# EAGLE design n64advanced (EAGLE 8.4.3)

## Sheet 1 of 2
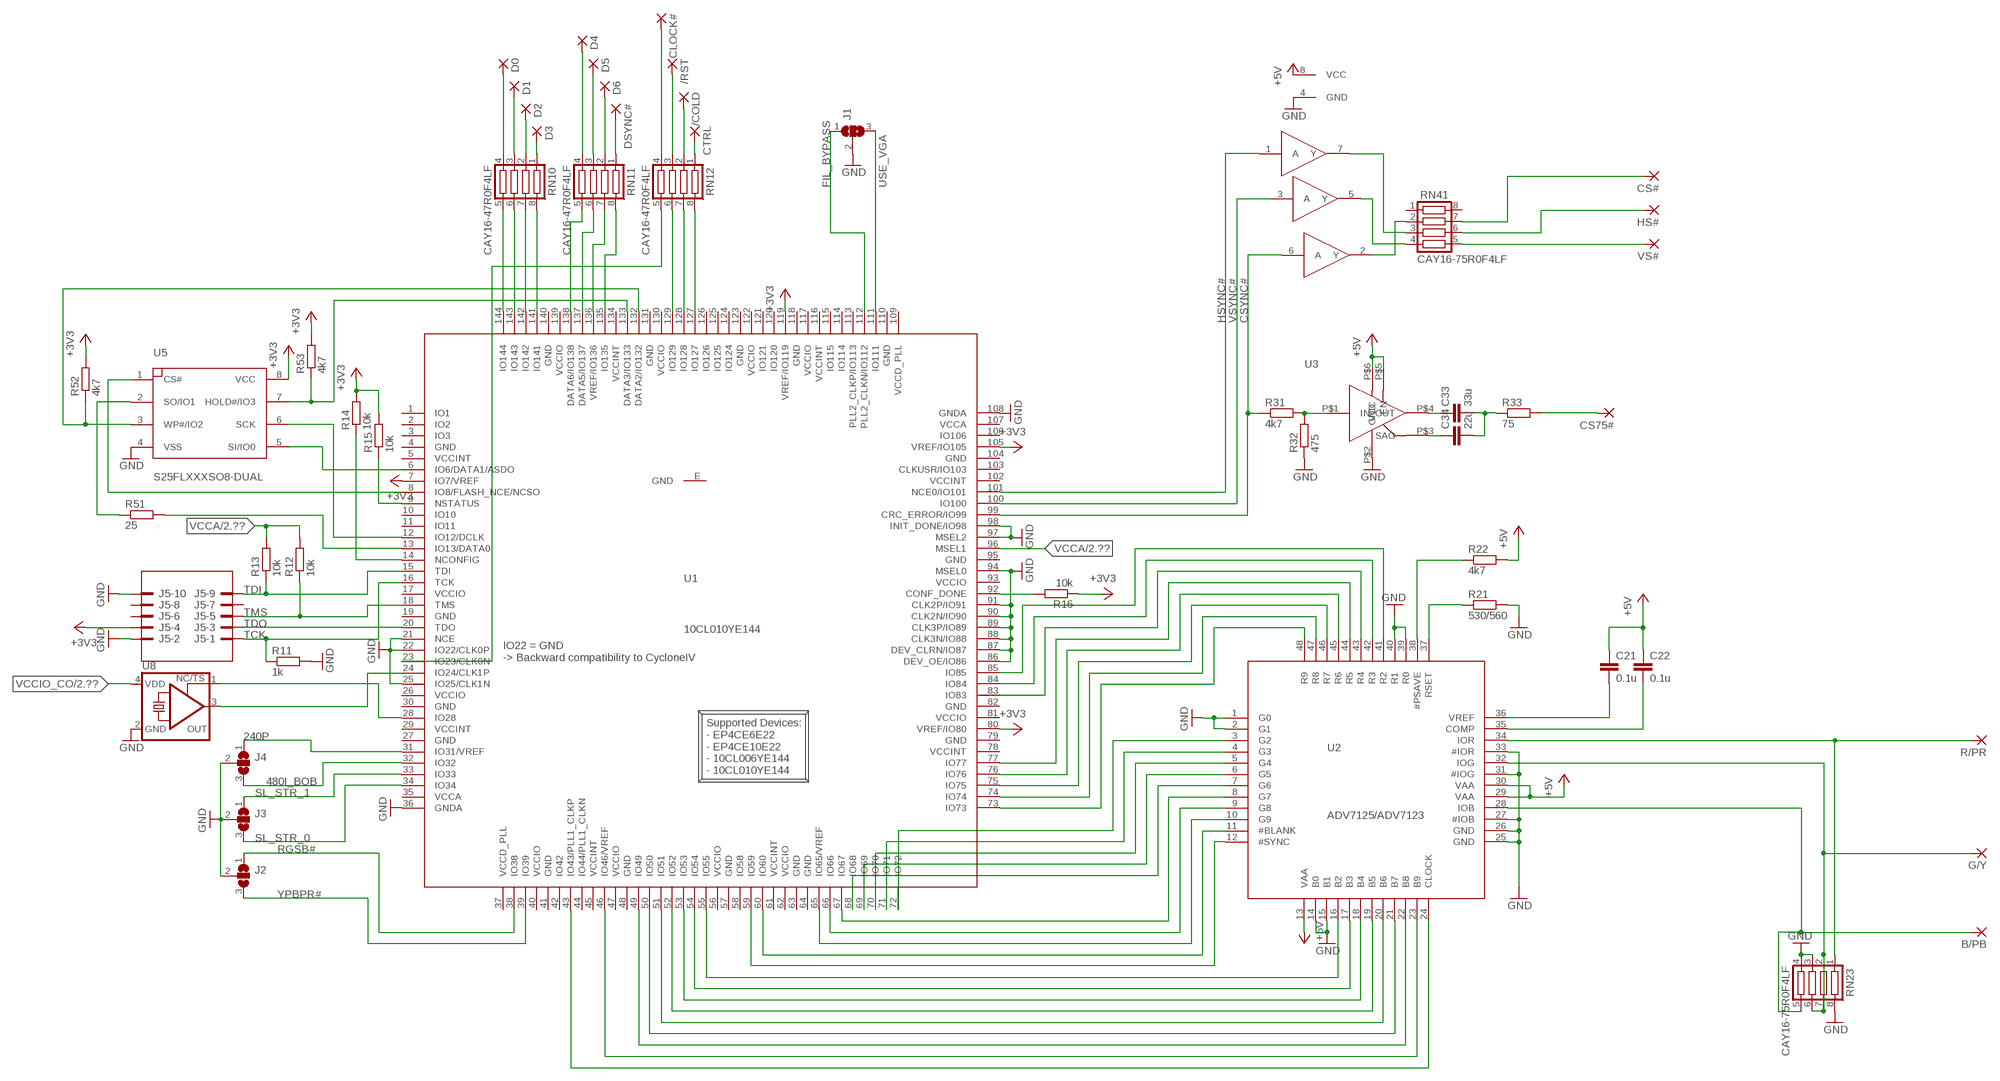
[diagram p0: schematic, sheet 1]

### Parts
/COLD  SMD2  [SMD1,27-2,54]
/RST  SMD2  [SMD1,27-2,54]
B/PB  SMD2  [SMD1,27-2,54]
C21  0.1u  C-EUC0603  [C0603]
C22  0.1u  C-EUC0603  [C0603]
C33  33u  C-EUC1210  [C1210]
C34  22u  C-EUC1206  [C1206]
CLOCK#  SMD1  [SMD0,8-1,6]
CS75#  SMD2  [SMD1,27-2,54]
CS#  SMD2  [SMD1,27-2,54]
CTRL  SMD2  [SMD1,27-2,54]
D0  SMD1  [SMD0,8-1,6]
D1  SMD1  [SMD0,8-1,6]
D2  SMD1  [SMD0,8-1,6]
D3  SMD1  [SMD0,8-1,6]
D4  SMD1  [SMD0,8-1,6]
D5  SMD1  [SMD0,8-1,6]
D6  SMD1  [SMD0,8-1,6]
DSYNC#  SMD1  [SMD0,8-1,6]
G/Y  SMD2  [SMD1,27-2,54]
HS#  SMD2  [SMD1,27-2,54]
J1  SJ2W  [SJ_2]
J2  SJ2W  [SJ_2]
J3  SJ2W  [SJ_2]
J4  SJ2W  [SJ_2]
J5  2510-  [PAK100/2500-10]
R11  1k  R-EU_R0603  [R0603]
R12  10k  R-EU_R0603  [R0603]
R13  10k  R-EU_R0603  [R0603]
R14  10k  R-EU_R0603  [R0603]
R15  10k  R-EU_R0603  [R0603]
R16  10k  R-EU_R0603  [R0603]
R21  530/560  R-EU_R0603  [R0603]
R22  4k7  R-EU_R0603  [R0603]
R31  4k7  R-EU_R0603  [R0603]
R32  475  R-EU_R0603  [R0603]
R33  75  R-EU_R0603  [R0603]
R51  25  R-EU_R0603  [R0603]
R52  4k7  R-EU_R0603  [R0603]
R53  4k7  R-EU_R0603  [R0603]
R/PR  SMD2  [SMD1,27-2,54]
RN10  CAY16-47R0F4LF  CTS742C083  [CTS742C083]
RN11  CAY16-47R0F4LF  CTS742C083  [CTS742C083]
RN12  CAY16-47R0F4LF  CTS742C083  [CTS742C083]
RN23  CAY16-75R0F4LF  CTS742C083  [CTS742C083]
RN41  CAY16-75R0F4LF  CTS742C083  [CTS742C083]
U1  10CL010YE144  [EQFP144_2]
U2  ADV7125/ADV7123  ADV7123  [LQFP48]
U3  TSH122ICT  [SC70]
U4  74LVC3G17  74LVC3G34  [74LVC3G34]
U5  S25FLXXXSO8-DUAL  [SO8-DUAL]
U8  KXO-PXO/XO-V96  [3.2X2.5_KXO-V96]
VS#  SMD2  [SMD1,27-2,54]

### Nets
240P: J4.1 U1.31(IO31/VREF)
480I_BOB: J4.3 U1.32(IO32)
+5V: C21.1 C22.1 R22.2 U2.13(VAA) U2.29(VAA) U2.30(VAA) U3.P$5(EN) U3.P$6(VCC) U4.8(VCC) ; also sheet 2
BLUE: B/PB.1(P) RN23.5 U2.28(IOB)
CSYNC47#: CS#.1(P) RN41.7
CSYNC#: R31.1 U1.99(CRC_ERROR/IO99) U4.6(A)
FIL_BYPASS: J1.1 U1.112(PLL2_CLKN/IO112)
GND: J1.2 J2.2 J3.2 J4.2 J5.2 J5.10 R11.2 R21.2 R32.1 RN23.3 RN23.4 RN23.8 U1.21(NCE) U1.22(IO22/CLK0P) U1.25(IO25/CLK1N) U1.36(GNDA) U1.86(DEV_OE/IO86) U1.87(DEV_CLRN/IO87) U1.88(CLK3N/IO88) U1.89(CLK3P/IO89) U1.90(CLK2N/IO90) U1.91(CLK2P/IO91) U1.94(MSEL0) U1.97(MSEL2) U1.98(INIT_DONE/IO98) U1.108(GNDA) U2.1(G0) U2.2(G1) U2.14(B0) U2.15(B1) U2.25(GND) U2.26(GND) U2.27(#IOB) U2.31(#IOG) U2.33(#IOR) U2.39(R0) U2.40(R1) U3.P$2(GND) U4.4(GND) U5.4(VSS) U8.2(GND) ; also sheet 2
GREEN: G/Y.1(P) RN23.2 RN23.6 RN23.7 U2.32(IOG)
HSYNC47#: HS#.1(P) RN41.6
HSYNC#: U1.101(NCE0/IO101) U4.1(A)
N$1: R31.2 R32.2 U3.P$1(IN)
N$2: R21.1 U2.37(RSET)
N$3: RN12.5 U1.23(IO23/CLK0N)
N$4: U1.43(IO43/PLL1_CLKP) U2.24(CLOCK)
N$5: U1.46(IO46/VREF) U2.23(B9)
N$6: U1.49(IO49) U2.22(B8)
N$7: U1.50(IO50) U2.21(B7)
N$8: R14.1 U1.14(NCONFIG)
N$9: U1.51(IO51) U2.20(B6)
N$10: U1.52(IO52) U2.19(B5)
N$11: U1.53(IO53) U2.18(B4)
N$12: U1.54(IO54) U2.17(B3)
N$13: U1.55(IO55) U2.16(B2)
N$14: U1.72(IO72) U2.3(G2)
N$15: C33.1 U3.P$4(OUT)
N$16: C34.1 U3.P$3(SAG)
N$17: C33.2 C34.2 R33.1
N$18: U1.71(IO71) U2.4(G3)
N$19: U1.70(IO70) U2.5(G4)
N$20: U1.69(IO69) U2.6(G5)
N$21: CS75#.1(P) R33.2
N$22: R22.1 U2.38(#PSAVE)
N$23: C22.2 U2.35(COMP)
N$24: C21.2 U2.36(VREF)
N$25: R52.1 U1.132(DATA2/IO132) U5.3(WP#/IO2)
N$26: RN41.2 U4.2(Y)
N$27: U1.68(IO68) U2.7(G6)
N$28: U1.67(IO67) U2.8(G7)
N$29: U1.66(IO66) U2.9(G8)
N$30: U1.65(IO65/VREF) U2.10(G9)
N$31: U1.60(IO60) U2.11(#BLANK)
N$32: U1.59(IO59) U2.12(#SYNC)
N$33: U1.85(IO85) U2.41(R2)
N$34: U1.84(IO84) U2.42(R3)
N$35: U1.83(IO83) U2.43(R4)
N$36: U1.77(IO77) U2.44(R5)
N$37: U1.76(IO76) U2.45(R6)
N$38: U1.75(IO75) U2.46(R7)
N$39: U1.74(IO74) U2.47(R8)
N$40: U1.73(IO73) U2.48(R9)
N$41: RN10.5 U1.144(IO144)
N$42: RN10.6 U1.143(IO143)
N$43: RN10.7 U1.142(IO142)
N$44: RN10.8 U1.141(IO141)
N$45: R15.1 U1.9(NSTATUS)
N$46: RN11.5 U1.138(DATA6/IO138)
N$47: RN41.4 U4.5(Y)
N$49: RN11.6 U1.137(DATA5/IO137)
N$50: RN11.7 U1.136(VREF/IO136)
N$51: RN11.8 U1.135(IO135)
N$52: R16.2 U1.92(CONF_DONE)
N$53: D0.P$1(P) RN10.4
N$55: RN12.6 U1.129(IO129)
N$56: RN12.7 U1.128(IO128)
N$57: RN12.8 U1.127(IO127)
N$58: D1.P$1(P) RN10.3
N$59: D2.P$1(P) RN10.2
N$60: D3.P$1(P) RN10.1
N$61: D4.P$1(P) RN11.4
N$62: D5.P$1(P) RN11.3
N$63: D6.P$1(P) RN11.2
N$64: DSYNC#.P$1(P) RN11.1
N$65: CLOCK#.P$1(P) RN12.4
N$66: CTRL.1(P) RN12.1
N$67: /COLD.1(P) RN12.2
N$68: RN41.3 U4.7(Y)
N$69: R51.1 U5.2(SO/IO1)
N$70: /RST.1(P) RN12.3
N$72: R51.2 U1.13(IO13/DATA0)
N$73: U1.12(IO12/DCLK) U5.6(SCK)
N$74: R53.1 U1.133(DATA3/IO133) U5.7(HOLD#/IO3)
N$75: U1.8(IO8/FLASH_NCE/NCSO) U5.1(CS#)
N$76: U1.6(IO6/DATA1/ASDO) U5.5(SI/IO0)
N$77: U1.24(IO24/CLK1P) U8.3(OUT)
N$78: U1.28(IO28) U8.1(TS)
RED: R/PR.1(P) RN23.1 U2.34(IOR)
RGSB#: J2.1 U1.38(IO38)
SL_STR_0: J3.3 U1.34(IO34)
SL_STR_1: J3.1 U1.33(IO33)
TCK: J5.1 R11.1 U1.16(TCK)
TDI: J5.9 R13.1 U1.15(TDI)
TDO: J5.3 U1.20(TDO)
TMS: J5.5 R12.1 U1.18(TMS)
USE_VGA: J1.3 U1.111(IO111)
VCCA: R12.2 R13.2 U1.96(MSEL1) ; also sheet 2
VCCIO: J5.4 R14.2 R15.2 R16.1 R52.2 R53.2 U1.7(IO7/VREF) U1.80(VREF/IO80) U1.105(VREF/IO105) U1.119(VREF/IO119) U5.8(VCC) ; supply symbol labelled +3V3 ; also sheet 2
VCCIO_CO: U8.4(VDD) ; also sheet 2
VSYNC47#: RN41.5 VS#.1(P)
VSYNC#: U1.100(IO100) U4.3(A)
YPBPR#: J2.3 U1.39(IO39)
Unconnected: J5.6 J5.7 J5.8 RN41.1 RN41.8 U1.1(IO1) U1.2(IO2) U1.3(IO3) U1.10(IO10) U1.11(IO11) U1.42(IO42) U1.44(IO44/PLL1_CLKN) U1.58(IO58) U1.103(CLKUSR/IO103) U1.106(IO106) U1.113(PLL2_CLKP/IO113) U1.114(IO114) U1.115(IO115) U1.120(IO120) U1.121(IO121) U1.124(IO124) U1.125(IO125) U1.126(IO126)

### Notes on the sheet
- IO22 = GND
  -> Backward compatibility to CycloneIV
- Supported Devices:
  - EP4CE6E22
  - EP4CE10E22
  - 10CL006YE144
  - 10CL010YE144

## Sheet 2 of 2
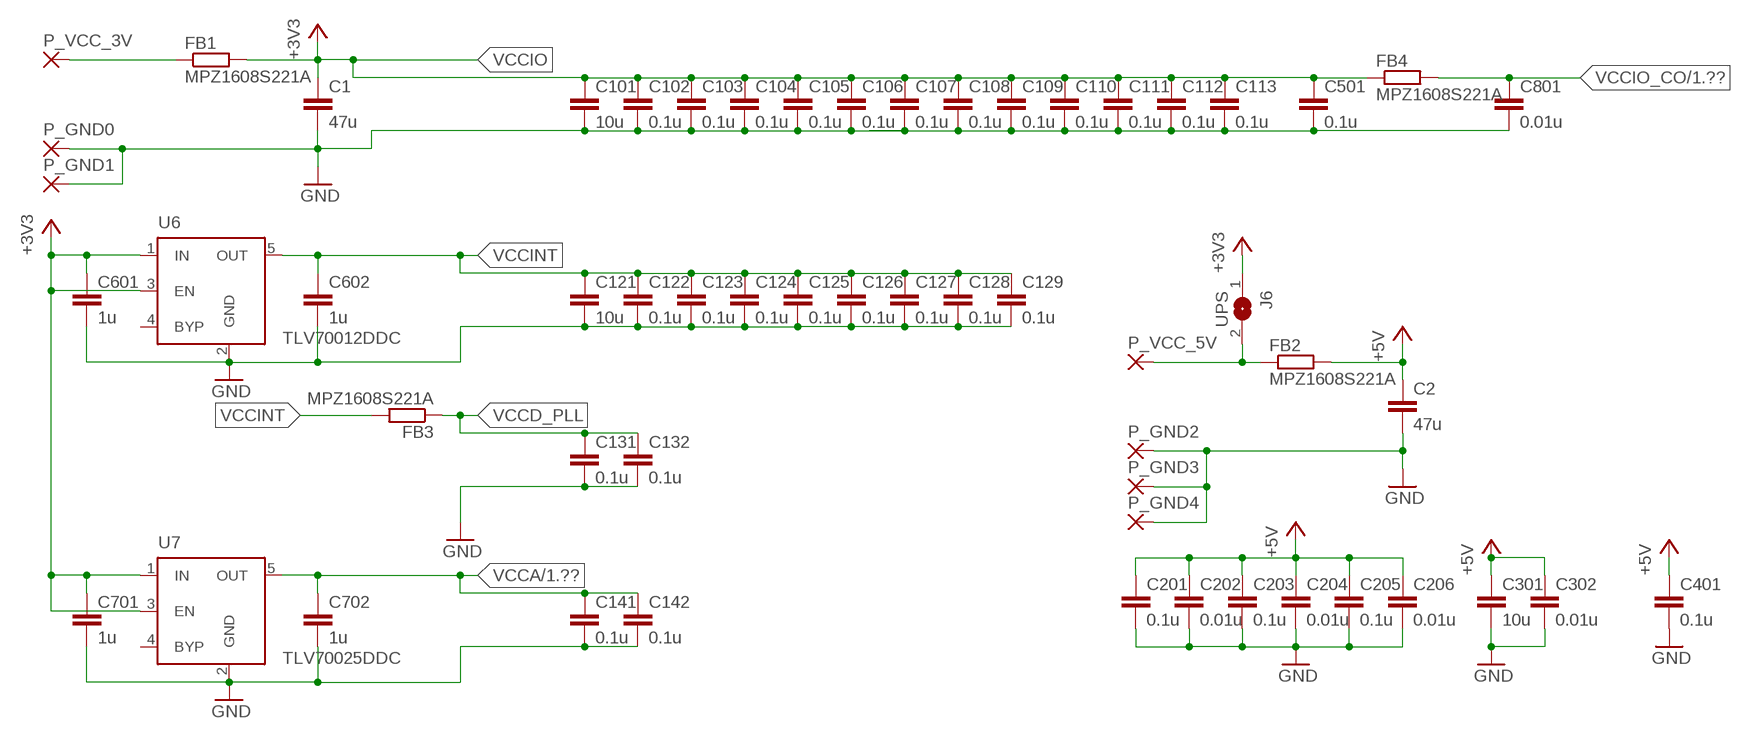
[diagram p1: schematic, sheet 2]

### Parts
C1  47u  C-EUC0805  [C0805]
C2  47u  C-EUC0805  [C0805]
C101  10u  C-EUC0805  [C0805]
C102  0.1u  C-EUC0603  [C0603]
C103  0.1u  C-EUC0603  [C0603]
C104  0.1u  C-EUC0603  [C0603]
C105  0.1u  C-EUC0603  [C0603]
C106  0.1u  C-EUC0603  [C0603]
C107  0.1u  C-EUC0603  [C0603]
C108  0.1u  C-EUC0603  [C0603]
C109  0.1u  C-EUC0603  [C0603]
C110  0.1u  C-EUC0603  [C0603]
C111  0.1u  C-EUC0603  [C0603]
C112  0.1u  C-EUC0603  [C0603]
C113  0.1u  C-EUC0603  [C0603]
C121  10u  C-EUC0805  [C0805]
C122  0.1u  C-EUC0603  [C0603]
C123  0.1u  C-EUC0603  [C0603]
C124  0.1u  C-EUC0603  [C0603]
C125  0.1u  C-EUC0603  [C0603]
C126  0.1u  C-EUC0603  [C0603]
C127  0.1u  C-EUC0603  [C0603]
C128  0.1u  C-EUC0603  [C0603]
C129  0.1u  C-EUC0603  [C0603]
C131  0.1u  C-EUC0603  [C0603]
C132  0.1u  C-EUC0603  [C0603]
C141  0.1u  C-EUC0603  [C0603]
C142  0.1u  C-EUC0603  [C0603]
C201  0.1u  C-EUC0603  [C0603]
C202  0.01u  C-EUC0603  [C0603]
C203  0.1u  C-EUC0603  [C0603]
C204  0.01u  C-EUC0603  [C0603]
C205  0.1u  C-EUC0603  [C0603]
C206  0.01u  C-EUC0603  [C0603]
C301  10u  C-EUC0805  [C0805]
C302  0.01u  C-EUC0603  [C0603]
C401  0.1u  C-EUC0603  [C0603]
C501  0.1u  C-EUC0603  [C0603]
C601  1u  C-EUC0603  [C0603]
C602  1u  C-EUC0603  [C0603]
C701  1u  C-EUC0603  [C0603]
C702  1u  C-EUC0603  [C0603]
C801  0.01u  C-EUC0603  [C0603]
FB1  MPZ1608S221A  R-EU_R0603  [R0603]
FB2  MPZ1608S221A  R-EU_R0603  [R0603]
FB3  MPZ1608S221A  R-EU_R0603  [R0603]
FB4  MPZ1608S221A  R-EU_R0603  [R0603]
J6  UPS  SJ  [SJ]
P_GND0  SMD2  [SMD1,27-2,54]
P_GND1  SMD2  [SMD1,27-2,54]
P_GND2  SMD2  [SMD1,27-2,54]
P_GND3  SMD2  [SMD1,27-2,54]
P_GND4  SMD2  [SMD1,27-2,54]
P_VCC_3V  SMD2  [SMD1,27-2,54]
P_VCC_5V  SMD2  [SMD1,27-2,54]
U6  TLV70012DDC  MIC5219XX  [SOT23-5]
U7  TLV70025DDC  MIC5219XX  [SOT23-5]

### Nets
+5V: C2.1 C201.1 C202.1 C203.1 C204.1 C205.1 C206.1 C301.1 C302.1 C401.1 FB2.2 ; also sheet 1
GND: C1.2 C2.2 C101.2 C102.2 C103.2 C104.2 C105.2 C106.2 C107.2 C108.2 C109.2 C110.2 C111.2 C112.2 C113.2 C121.2 C122.2 C123.2 C124.2 C125.2 C126.2 C127.2 C128.2 C129.2 C131.2 C132.2 C141.2 C142.2 C201.2 C202.2 C203.2 C204.2 C205.2 C206.2 C301.2 C302.2 C401.2 C501.2 C601.2 C602.2 C701.2 C702.2 C801.2 P_GND0.1(P) P_GND1.1(P) P_GND2.1(P) P_GND3.1(P) P_GND4.1(P) U6.2(GND) U7.2(GND) ; also sheet 1
N$48: FB2.1 J6.2 P_VCC_5V.1(P)
N$54: FB1.1 P_VCC_3V.1(P)
VCCA: C141.1 C142.1 C702.1 U7.5(OUT) ; also sheet 1
VCCD_PLL: C131.1 C132.1 FB3.1
VCCINT: C121.1 C122.1 C123.1 C124.1 C125.1 C126.1 C127.1 C128.1 C129.1 C602.1 FB3.2 U6.5(OUT)
VCCIO: C1.1 C101.1 C102.1 C103.1 C104.1 C105.1 C106.1 C107.1 C108.1 C109.1 C110.1 C111.1 C112.1 C113.1 C501.1 C601.1 C701.1 FB1.2 FB4.1 J6.1 U6.1(IN) U6.3(EN) U7.1(IN) U7.3(EN) ; supply symbol labelled +3V3 ; also sheet 1
VCCIO_CO: C801.1 FB4.2 ; also sheet 1
Unconnected: U6.4(BYP) U7.4(BYP)

## Power pins joined to a net without a drawn wire
GND: U1.4(GND) U1.19(GND) U1.27(GND) U1.30(GND) U1.41(GND) U1.48(GND) U1.57(GND) U1.63(GND) U1.64(GND) U1.79(GND) U1.82(GND) U1.95(GND) U1.104(GND) U1.110(GND) U1.118(GND) U1.123(GND) U1.131(GND) U1.140(GND) U1.E(GND)
VCCA: U1.35(VCCA) U1.107(VCCA)
VCCD_PLL: U1.37(VCCD_PLL) U1.109(VCCD_PLL)
VCCINT: U1.5(VCCINT) U1.29(VCCINT) U1.45(VCCINT) U1.61(VCCINT) U1.78(VCCINT) U1.102(VCCINT) U1.116(VCCINT) U1.134(VCCINT)
VCCIO: U1.17(VCCIO) U1.26(VCCIO) U1.40(VCCIO) U1.47(VCCIO) U1.56(VCCIO) U1.62(VCCIO) U1.81(VCCIO) U1.93(VCCIO) U1.117(VCCIO) U1.122(VCCIO) U1.130(VCCIO) U1.139(VCCIO)

## Library data of the parts
/COLD /RST B/PB CS75# CS# CTRL G/Y HS# P_GND0 P_GND1-P_GND4 P_VCC_3V P_VCC_5V R/PR VS# = wirepad@1:SMD2: SMD PAD
C1 C2 C21 C22 C34 C101-C113 C121-C129 C131 C132 C141 C142 C201-C206 C301 C302 C401 C501 C601 C602 C701 C702 C801 = rcl:C-EU: CAPACITOR, European symbol
C33 = rcl@1:C-EU: CAPACITOR, European symbol
CLOCK# D0 D1-D6 DSYNC# = wirepad:SMD1
FB1-FB4 R11-R16 R21 R22 R31-R33 R51-R53 = rcl:R-EU_: RESISTOR, European symbol
J1-J4 = jumper:SJ2W: SMD solder JUMPER
J5 = con-3m:2510-: 3M (TM) Pak 100 4-Wall Header Source: 3M; MF: 3M; MPN: 2510-6002UB; OC_FARNELL: 9838244; OC_NEWARK: 46F4725
J6 = jumper:SJ: SMD solder JUMPER
RN10-RN12 RN23 RN41 = resistor-net:CTS742C083: Chip Resistor Array 4 Single Resistor Source: http://www.ctscorp.com/components/Datasheets/CTSChipArrayDs.pdf; OC_FARNELL: unknown; OC_NEWARK: unknown
U1 = altera:10CL010
U2 = analog-devices:ADV7123
U3 = st-microelectronics:TSH122
U4 = OSSC_HDMI_Audio:74LVC3G34
U5 = cypress:S25FLXXX
U6 U7 = v-reg-micrel:MIC5219XX: VOLTAGE REGULATOR; OC_FARNELL: unknown; OC_NEWARK: unknown
U8 = crystal-geyer_V1_0:KXO-PXO/XO-V: Clock Oscillator (PXO/XO) MHz : KXO-V - Serie Model Size l/w/h [mm] Frequency Range Frequency Stability Temp. Range [°C] Output AECQ 200 availabel Datasheet KXO-V94 KXO-V94 KXO-V95 KXO-V95 KXO-V96 KXO-V96 KXO-V99 KXO-V99 KXO-97 KXO-V97 KXO-97 - KXO-V97 2.0/1.6/0.80 2.0/1.6/0.80 2.5/2.0/0.82 2.5/2.0/0.82 3.2/2.5/1.2 3.2/2.5/1.2 5.0/3.2/1.2 5.0/3.2/1.2 7.0/5.08/1.3 7.0/5.08/1.3 7.0/5.08/1.3 32,768 kHz 1,0 ~ 80,0 MHz 32,768 kHz 1,0 ~ 70,0 MHz 32,768 kHz 1,0 ~ 156,0 MHz 32,768 kHz 1,0 ~ 200,0 MHz 32,768 kHz 32,768 kHz 1,0 ~ 160,0 MHz ±25 … ±100ppm ±25 … ±100ppm ±25 … ±100ppm ±25 … ±100ppm ±25 … ±100ppm ±25 … ±100ppm ±25 … ±100ppm ±25 … ±100ppm ±25 … ±100ppm ±25 … ±100ppm ±25 … ±100ppm (*) -40°C …+85°C (*) -40°C …+85°C (*) -40°C …+85°C (*) -40°C …+85°C (*) -40°C …+85°C (*) -40°C …+85°C (*) -40°C …+85°C (*) -40°C …+85°C (*) -40°C …+85°C (*) -40°C …+85°C (*) -40°C …+85°C HCMOS HCMOS HCMOS HCMOS HCMOS HCMOS HCMOS HCMOS HCMOS HCMOS HCMOS - - yes yes yes yes - - - - - KXO-V94-kHz.pdf <http://www.geyer-electronic.de/uploads/tx_userartikelfrequenz/GEYER-KXO-V94-kHz.pdf> KXO-V94.pdf <http://www.geyer-electronic.de/uploads/tx_userartikelfrequenz/GEYER-KXO-V94.pdf> KXO-V95-kHz.pdf <http://www.geyer-electronic.de/uploads/tx_userartikelfrequenz/GEYER-KXO-V95-kHz.pdf> KXO-V95.pdf <http://www.geyer-electronic.de/uploads/tx_userartikelfrequenz/GEYER-KXO-V95.pdf> KXO-V96-kHz.pdf <http://www.geyer-electronic.de/uploads/tx_userartikelfrequenz/GEYER-KXO-V96-kHz.pdf> KXO-V96.pdf <http://www.geyer-electronic.de/uploads/tx_userartikelfrequenz/GEYER-KXO-V96.pdf> KXO-V99-kHz.pdf <http://www.geyer-electronic.de/uploads/tx_userartikelfrequenz/GEYER-KXO-V99-kHz.pdf> KXO-V99.pdf <http://www.geyer-electronic.de/uploads/tx_userartikelfrequenz/GEYER-KXO-V99.pdf> KXO-97-kHz.pdf <http://www.geyer-electronic.de/uploads/tx_userartikelfrequenz/GEYER-KXO-97-kHz.pdf> KXO-V97-kHz.pdf <http://www.geyer-electronic.de/uploads/tx_userartikelfrequenz/GEYER-KXO-V97-kHz.pdf> KXO-V97.pdf <http://www.geyer-electronic.de/uploads/tx_userartikelfrequenz/GEYER-KXO-V97.pdf> <http://www.geyer-electronic.de/fileadmin/template/img/logo-geyer-electronic.png> Details see: http://www.geyer-electronic.de/Frequenz-Produkte.9.0.html Created 2016-06-07, Hans Locher 2016 (C) Geyer Quartz Technology Hans Locher KXOV94,KXOV95;KXOV96;KXOV97;KXO97;2016;2520;3225;5032;70508;2,5x2,0;3,2x2,5;5,0x3,2;7,0x5,08;2.5x2.0;3.2x2.5;5.0x3.2;7.0x5.08;

## Board
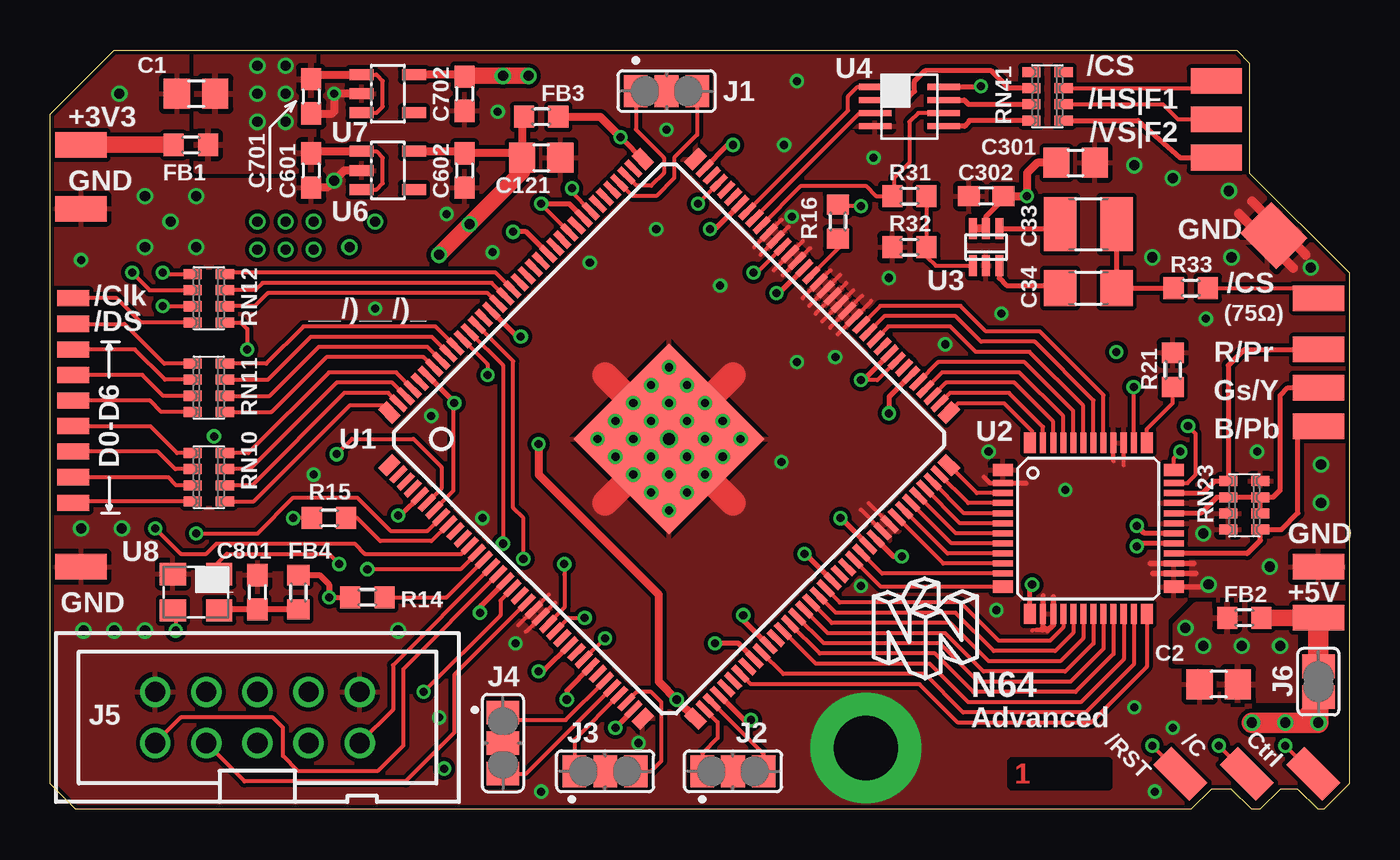
[diagram p2: board, top side]
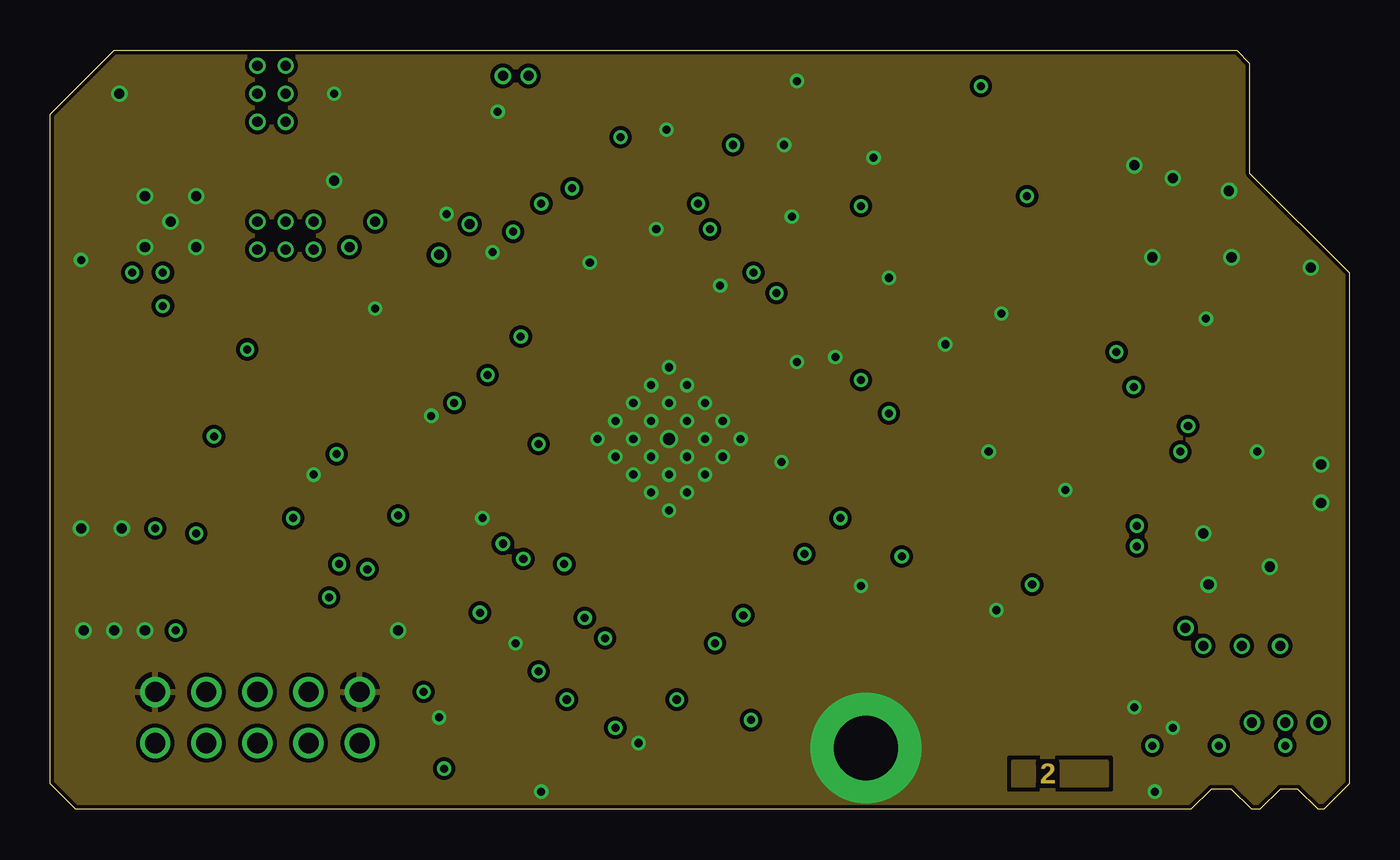
[diagram p3: board, inner layer Route2]
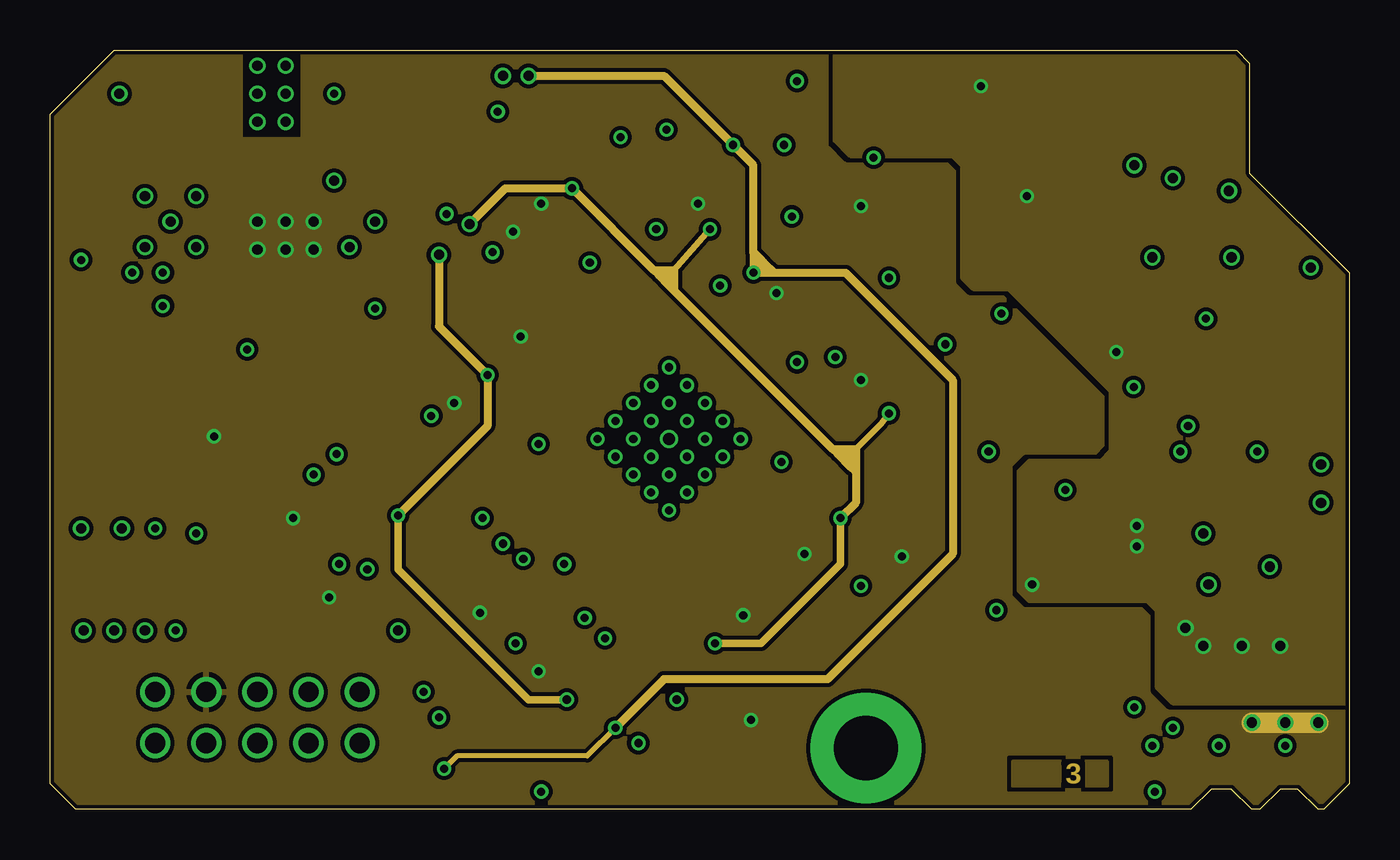
[diagram p4: board, inner layer Route15]
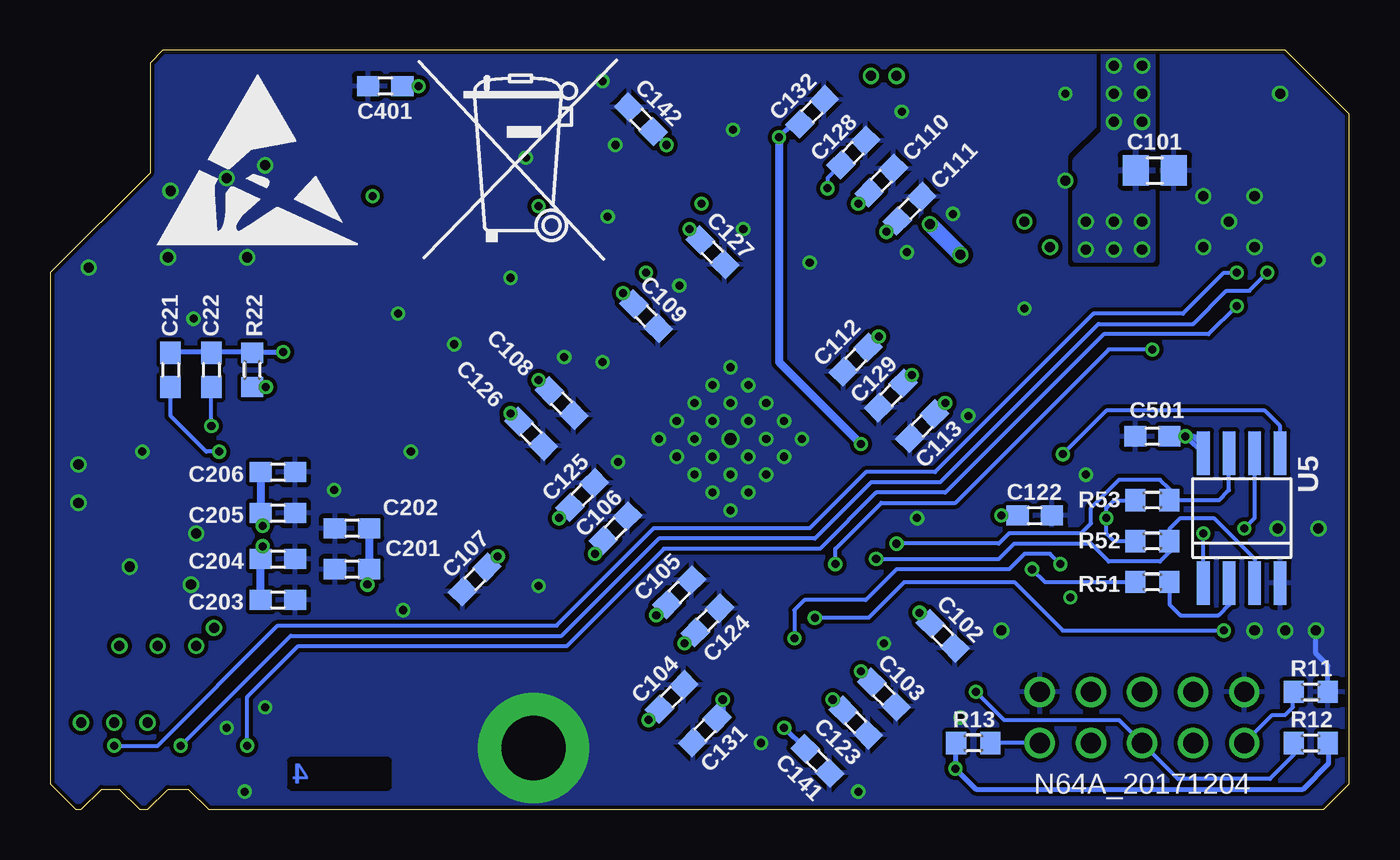
[diagram p5: board, bottom side, seen from below]

Size 64.52 x 37.72 mm. Coordinates in mm from the lower left corner, seen from the top.
Outline: 1.27,0 0,1.27 0,34.54 3.17,37.72 58.93,37.72 59.56,37.08 59.56,31.62 64.52,26.67 64.52,1.27 63.25,0 62.99,0 61.98,1.02 61.09,1.02 60.07,0 59.69,0 58.67,1.02 57.66,1.02 56.64,0 1.27,0
Copper layers (1+2*15+16): Top 0.035mm / dielectric 0.2mm / Route2 0.035mm / dielectric 1.15mm / Route15 0.035mm / dielectric 0.2mm / Bottom 0.035mm
Design rules "PCBCart *": minimum track width 0.2mm, minimum drill 0.4mm, track to track 0.2mm, track to pad 0.2mm, pad to pad 0.2mm, via to via 0.2mm, smd to smd 0mil, copper to edge 0.2mm, drill to drill 0.2mm, minimum pad ring 10mil, minimum via ring 6mil, stop-mask expansion 2mil, vias tented up to drill 30mil, thermal gap 10mil
tRestrict: area 47.7,1 to 52.7,2.5; area 7,11.9 to 7.5,12.4; area 9.1,11.9 to 9.7,12.4; area 11,11.9 to 11.6,12.4; area 15.4,9.8 to 16.1,11.4; 2 lines
bRestrict: area 47.7,1 to 52.7,2.5

### Footprints (pad centres in the part's own frame; a part is rotated, then mirrored left to right if it is on the bottom)
SMD1,27-2,54 = smd 1.27 x 2.54: 1 0,0
C0805 = smd 1.3 x 1.5: 1 -0.95,0; 2 0.95,0
C0603 = smd 1.1 x 1: 1 -0.85,0; 2 0.85,0
C1210 = smd 1.6 x 2.7: 1 -1.4,0; 2 1.4,0
C1206 = smd 1.6 x 1.8: 1 -1.4,0; 2 1.4,0
SMD0,8-1,6 = smd 0.8 x 1.6: P$1 0,0
R0603 = smd 1 x 1.1: 1 -0.85,0; 2 0.85,0
SJ_2 = smd 1.168 x 1.6: 1 -1.524,0; 2 0,0; 3 1.524,0
PAK100/2500-10 = drill 1 pad 1.422: 1 -5.08,-1.27; 2 -5.08,1.27; 3 -2.54,-1.27; 4 -2.54,1.27; 5 0,-1.27; 6 0,1.27; 7 2.54,-1.27; 8 2.54,1.27; 9 5.08,-1.27; 10 5.08,1.27
SJ = smd 1.168 x 1.6: 1 -0.762,0; 2 0.762,0
CTS742C083 = smd 0.5 x 0.9: 1 -1.2,-0.8; 2 -0.4,-0.8; 3 0.4,-0.8; 4 1.2,-0.8; 5 1.2,0.8; 6 0.4,0.8; 7 -0.4,0.8; 8 -1.2,0.8
EQFP144_2 = smd 1 x 0.6: 1 -10.75,8.9; 36 -10.75,-8.9; 73 10.75,-8.9; 108 10.75,8.9 | smd 1 x 0.3: 2 -10.75,8.25; 3 -10.75,7.75; 4 -10.75,7.25; 5 -10.75,6.75; 6 -10.75,6.25; 7 -10.75,5.75; 8 -10.75,5.25; 9 -10.75,4.75; 10 -10.75,4.25; 11 -10.75,3.75; 12 -10.75,3.25; 13 -10.75,2.75; 14 -10.75,2.25; 15 -10.75,1.75; 16 -10.75,1.25; 17 -10.75,0.75; 18 -10.75,0.25; 19 -10.75,-0.25; 20 -10.75,-0.75; 21 -10.75,-1.25; 22 -10.75,-1.75; 23 -10.75,-2.25; 24 -10.75,-2.75; 25 -10.75,-3.25; 26 -10.75,-3.75; 27 -10.75,-4.25; 28 -10.75,-4.75; 29 -10.75,-5.25; 30 -10.75,-5.75; 31 -10.75,-6.25; 32 -10.75,-6.75; 33 -10.75,-7.25; 34 -10.75,-7.75; 35 -10.75,-8.25; 74 10.75,-8.25; 75 10.75,-7.75; 76 10.75,-7.25; 77 10.75,-6.75; 78 10.75,-6.25; 79 10.75,-5.75; 80 10.75,-5.25; 81 10.75,-4.75; 82 10.75,-4.25; 83 10.75,-3.75; 84 10.75,-3.25; 85 10.75,-2.75; 86 10.75,-2.25; 87 10.75,-1.75; 88 10.75,-1.25; 89 10.75,-0.75; 90 10.75,-0.25; 91 10.75,0.25; 92 10.75,0.75; 93 10.75,1.25; 94 10.75,1.75; 95 10.75,2.25; 96 10.75,2.75; 97 10.75,3.25; 98 10.75,3.75; 99 10.75,4.25; 100 10.75,4.75; 101 10.75,5.25; 102 10.75,5.75; 103 10.75,6.25; 104 10.75,6.75; 105 10.75,7.25; 106 10.75,7.75; 107 10.75,8.25 | smd 0.6 x 1: 37 -8.9,-10.75; 72 8.9,-10.75; 109 8.9,10.75; 144 -8.9,10.75 | smd 0.3 x 1: 38 -8.25,-10.75; 39 -7.75,-10.75; 40 -7.25,-10.75; 41 -6.75,-10.75; 42 -6.25,-10.75; 43 -5.75,-10.75; 44 -5.25,-10.75; 45 -4.75,-10.75; 46 -4.25,-10.75; 47 -3.75,-10.75; 48 -3.25,-10.75; 49 -2.75,-10.75; 50 -2.25,-10.75; 51 -1.75,-10.75; 52 -1.25,-10.75; 53 -0.75,-10.75; 54 -0.25,-10.75; 55 0.25,-10.75; 56 0.75,-10.75; 57 1.25,-10.75; 58 1.75,-10.75; 59 2.25,-10.75; 60 2.75,-10.75; 61 3.25,-10.75; 62 3.75,-10.75; 63 4.25,-10.75; 64 4.75,-10.75; 65 5.25,-10.75; 66 5.75,-10.75; 67 6.25,-10.75; 68 6.75,-10.75; 69 7.25,-10.75; 70 7.75,-10.75; 71 8.25,-10.75; 110 8.25,10.75; 111 7.75,10.75; 112 7.25,10.75; 113 6.75,10.75; 114 6.25,10.75; 115 5.75,10.75; 116 5.25,10.75; 117 4.75,10.75; 118 4.25,10.75; 119 3.75,10.75; 120 3.25,10.75; 121 2.75,10.75; 122 2.25,10.75; 123 1.75,10.75; 124 1.25,10.75; 125 0.75,10.75; 126 0.25,10.75; 127 -0.25,10.75; 128 -0.75,10.75; 129 -1.25,10.75; 130 -1.75,10.75; 131 -2.25,10.75; 132 -2.75,10.75; 133 -3.25,10.75; 134 -3.75,10.75; 135 -4.25,10.75; 136 -4.75,10.75; 137 -5.25,10.75; 138 -5.75,10.75; 139 -6.25,10.75; 140 -6.75,10.75; 141 -7.25,10.75; 142 -7.75,10.75; 143 -8.25,10.75 | smd 6.7 x 6.7: E 0,0
LQFP48 = smd 1 x 0.6: 1 -4.25,2.9; 12 -4.25,-2.9; 25 4.25,-2.9; 36 4.25,2.9 | smd 1 x 0.3: 2 -4.25,2.25; 3 -4.25,1.75; 4 -4.25,1.25; 5 -4.25,0.75; 6 -4.25,0.25; 7 -4.25,-0.25; 8 -4.25,-0.75; 9 -4.25,-1.25; 10 -4.25,-1.75; 11 -4.25,-2.25; 26 4.25,-2.25; 27 4.25,-1.75; 28 4.25,-1.25; 29 4.25,-0.75; 30 4.25,-0.25; 31 4.25,0.25; 32 4.25,0.75; 33 4.25,1.25; 34 4.25,1.75; 35 4.25,2.25 | smd 0.6 x 1: 13 -2.9,-4.25; 24 2.9,-4.25; 37 2.9,4.25; 48 -2.9,4.25 | smd 0.3 x 1: 14 -2.25,-4.25; 15 -1.75,-4.25; 16 -1.25,-4.25; 17 -0.75,-4.25; 18 -0.25,-4.25; 19 0.25,-4.25; 20 0.75,-4.25; 21 1.25,-4.25; 22 1.75,-4.25; 23 2.25,-4.25; 38 2.25,4.25; 39 1.75,4.25; 40 1.25,4.25; 41 0.75,4.25; 42 0.25,4.25; 43 -0.25,4.25; 44 -0.75,4.25; 45 -1.25,4.25; 46 -1.75,4.25; 47 -2.25,4.25
SC70 = smd 0.4 x 1.05: P$1 -0.65,-0.925; P$2 0,-0.925; P$3 0.65,-0.925; P$4 0.65,0.925; P$5 0,0.925; P$6 -0.65,0.925
74LVC3G34 = smd 1.6 x 0.3: 1 -1.7,0.975; 2 -1.7,0.325; 3 -1.7,-0.325; 4 -1.7,-0.975; 5 1.7,-0.975; 6 1.7,-0.325; 7 1.7,0.325; 8 1.7,0.975
SO8-DUAL = smd 2.159 x 0.635: 1 -3.226,1.905; 2 -3.226,0.635; 3 -3.226,-0.635; 4 -3.226,-1.905; 5 3.226,-1.905; 6 3.226,-0.635; 7 3.226,0.635; 8 3.226,1.905
SOT23-5 = smd 0.55 x 1.2: 1 -0.95,-1.3; 2 0,-1.3; 3 0.95,-1.3; 4 0.95,1.3; 5 -0.95,1.3
3.2X2.5_KXO-V96 = smd 1.3 x 1.1: 1 -1.15,-0.9; 2 1.15,-0.9; 3 1.15,0.9; 4 -1.15,0.9

### Placement (x,y rotation side)
/COLD  59.44,1.78 45 top
/RST  56.13,1.78 45 top
B/PB  62.99,19.05 90 top
C1  7.24,35.56 180 top
C2  58.04,6.22 180 top
C21  58.55,21.84 270 bottom
C22  56.52,21.84 270 bottom
C33  51.56,29.08 0 top
C34  51.56,25.91 0 top
C101  9.65,31.75 0 bottom
C102  20.19,8.64 315 bottom
C103  23.11,5.71 315 bottom
C104  33.66,5.59 45 bottom
C105  33.27,10.79 45 bottom
C106  36.45,13.97 45 bottom
C107  43.43,11.43 225 bottom
C108  39.12,20.19 315 bottom
C109  34.92,24.51 315 bottom
C110  23.24,31.24 45 bottom
C111  21.84,29.84 45 bottom
C112  24.51,22.35 225 bottom
C113  21.21,19.05 225 bottom
C121  24.38,32.38 0 top
C122  15.62,14.61 0 bottom
C123  24.51,4.32 315 bottom
C124  31.88,9.4 45 bottom
C125  38.1,15.62 45 bottom
C126  40.64,18.67 315 bottom
C127  31.62,27.69 315 bottom
C128  24.64,32.64 45 bottom
C129  22.76,20.57 225 bottom
C131  32,3.94 225 bottom
C132  26.68,34.66 45 bottom
C141  26.42,2.41 315 bottom
C142  35.18,34.29 135 bottom
C201  49.53,11.94 180 bottom
C202  49.53,13.97 180 bottom
C203  53.21,10.41 0 bottom
C204  53.21,12.45 0 bottom
C205  53.21,14.73 0 bottom
C206  53.21,16.76 0 bottom
C301  50.93,32.13 0 top
C302  46.48,30.48 180 top
C401  47.88,35.94 180 bottom
C501  9.78,18.54 180 bottom
C601  12.95,31.75 270 top
C602  20.57,31.75 270 top
C701  12.95,35.43 270 top
C702  20.57,35.56 270 top
C801  10.29,10.79 90 top
CLOCK#  1.14,25.4 270 top
CS75#  62.99,25.4 90 top
CS#  57.91,36.2 90 top
CTRL  62.74,1.78 45 top
D0  1.14,15.24 270 top
D1  1.14,16.51 270 top
D2  1.14,17.78 270 top
D3  1.14,19.05 270 top
D4  1.14,20.32 270 top
D5  1.14,21.59 270 top
D6  1.14,22.86 270 top
DSYNC#  1.14,24.13 270 top
FB1  6.98,33.02 0 top
FB2  59.31,9.53 180 top
FB3  24.38,34.42 180 top
FB4  12.32,10.79 270 top
G/Y  62.99,20.95 90 top
HS#  57.91,34.29 90 top
J1  30.61,35.69 180 top
J2  33.91,1.91 0 top
J3  27.56,1.91 0 top
J4  22.48,3.3 270 top
J5  10.29,4.57 0 top
J6  62.99,6.35 90 top
P_GND0  1.52,29.84 90 top
P_GND1  1.52,12.06 90 top
P_GND2  62.99,12.06 90 top
P_GND3  61.09,28.83 45 top
P_GND4  60.45,28.19 45 top
P_VCC_3V  1.52,33.02 90 top
P_VCC_5V  62.99,9.53 90 top
R11  1.91,5.84 0 bottom
R12  1.91,3.3 0 bottom
R13  18.67,3.3 180 bottom
R14  15.75,10.54 180 top
R15  13.84,14.48 180 top
R16  39.12,29.21 270 top
R21  518/515  [R0603]  55.75,21.84 90 top
R22  54.48,21.84 90 bottom
R31  42.67,30.48 0 top
R32  42.67,27.94 0 top
R33  56.64,25.91 0 top
R51  9.78,11.3 180 bottom
R52  9.78,13.34 180 bottom
R53  9.78,15.37 180 bottom
R/PR  62.99,22.86 90 top
RN10  7.87,16.51 270 top
RN11  7.87,20.95 270 top
RN12  7.87,25.4 270 top
RN23  59.31,15.11 270 top
RN41  49.53,35.43 270 top
U1  30.73,18.41 45 top
U2  51.56,13.97 0 top
U3  46.48,27.94 0 top
U4  42.67,34.92 0 top
U5  5.33,14.48 90 bottom
U6  16.76,31.75 270 top
U7  16.76,35.56 270 top
U8  7.24,10.79 180 top
U$1  [ESD_10.00]  59.31,27.94 0 bottom
U$2  [MUELLTONNE_10.00]  46.86,26.92 0 bottom
VS#  57.91,32.38 90 top

### Tracks (layer width: path | path; a pad name or v marks a point on that pad's centre or on a via)
240P
  Top 0.203: J4.1 22.86,4.45 25.6,4.45 U1.31
480I_BOB
  Top 0.203: J4.3 23.64,1.78 U1.32
+5V  (via drill 0.4, 0.5)
  Top 0.254: U2.13 48.66,10.94 v48.77,11.18 | U3.P$5 46.48,29.46 47.33,30.31 C302.1 | U4.8 46.19,35.9 v46.23,35.94 | U2.30 54.35,13.72 v53.98,14.1 | v53.98,13.08 54.11,13.22 U2.29
  Top 0.406: C301.1 49.02,32.13 48.51,31.62 v48.51,30.48 C302.1 | U3.P$5 U3.P$6
  Bottom 0.254: C201.1 48.93,11.21 v48.77,11.18 | 54.49,22.73 56.53,22.73 | 54.49,22.73 v52.96,22.73 | 56.53,22.73 58.51,22.73 C21.1 | C22.1 56.52,22.72 56.53,22.73 | R22.2 54.48,22.73 54.49,22.73 | C401.1 v46.23,35.94 | C204.1 53.81,12.41 v53.98,13.08 | C205.1 53.94,14.14 v53.98,14.1
  Bottom 0.406: C202.1 C201.1 | C206.1 C205.1 | C203.1 C204.1
  other vias: 61.09,8.13 56.39,9.02 57.28,8.13 59.18,8.13
  pour Top: 61.85,10.16 56.9,10.16 55.88,9.14 55.88,7.37 57.28,7.37 57.53,7.11 57.53,5.46 61.85,5.46
  pour Route15 (rank 3): 38.99,38.1 38.99,33.27 39.75,32.51 44.83,32.51 45.34,32 45.34,26.42 45.85,25.91 47.62,25.91 52.7,20.83 52.7,17.78 52.2,17.27 48.64,17.27 48.13,16.76 48.13,10.92 48.64,10.41 54.48,10.41 54.99,9.91 54.99,6.1 55.75,5.33 65.66,5.33 65.66,38.1
BLUE
  Top 0.254: U2.28 59.46,12.72 60.11,13.37 RN23.5 61.16,13.91 61.98,14.73 61.98,19.05 B/PB.1
CSYNC47#
  Top 0.203: RN41.7 57.55,35.83 CS#.1 58.42,36.2
CSYNC#
  Top 0.203: U4.6 43.11,34.6 42.67,34.16 42.67,32.13 41.91,31.37 41.91,30.57 R31.1 41.02,30.48 40.51,30.99 37.3,30.99 U1.99
FIL_BYPASS
  Top 0.203: J1.1 32.13,33.53 30.99,32.38 30.99,31.37 30.1,30.48 28.92,30.48 U1.112
GND  (via drill 0.4, 0.5, 0.6, 3.2 pad 5.5)
  Top 0.178: 49.3,9.12 49.15,8.92
  Top 0.203: 34.96,27.94 U1.98 36.32,29.3 | 35.28,27.56 U1.97 36.67,28.95 | 36.39,26.54 U1.94 37.73,27.89 | 35.93,26.8 U1.95 37.38,28.24 | 52.81,17.29 U2.40 | 53.31,17.12 U2.39 | U1.63 40.26,14.9 | U1.64 40.65,15.22 | U2.15 49.81,9.17 | 48.97,8.91 49.53,8.89 49.53,8.9 | 48.97,8.91 48.77,8.89 | 49.31,9.16 U2.14 | 48.97,8.91 49.15,8.92 49.56,8.94 49.53,8.9 | 49.53,8.9 49.53,8.94 49.31,9.16 | 49.28,8.89 49.3,9.12 49.31,9.16 | 46.67,16.22 U2.2 | 23.24,9.15 U1.21 24.75,10.67 | 25.08,10.29 U1.22 23.62,8.83 | 38.76,26.8 U1.91 37.37,25.4 | 39.24,26.57 U1.90 37.69,25.02 | 39.54,26.16 U1.89 38.02,24.64 | 39.88,25.79 U1.88 38.34,24.26 | 38.73,23.94 U1.87 40.32,25.53 | 39.12,23.61 U1.86 40.77,25.27
  Top 0.216: 46.67,16.22 46.38,16.51
  Top 0.254: 49.31,10.63 U2.14 | U2.39 53.31,18.51 | U2.40 52.81,18.39 52.83,18.41 | U2.2 48.48,16.22
  Top 0.279: 57.04,11.07 U2.25 | 56.91,11.72 U2.26 54.77,11.72 | 54.64,12.22 U2.27 56.8,12.22 | 49.81,10.57 U2.15 | 49.81,9.17 49.53,8.89
  Top 0.406: U6.2 14.61,31.75 v14.1,31.24 13.75,30.9 C601.2 | C701.2 14.01,34.58 | 14.1,34.67 v14.1,35.56 U7.2
  Top 0.508: 59.05,29.59 P_GND4.1 61.72,26.92 | 59.69,30.23 P_GND3.1 62.36,27.56
  Top 1.27: 27.56,21.59 U1.E | U1.E 33.91,21.59 | U1.E 33.91,15.24 | U1.E 27.56,15.24
  Bottom 0.254: R11.2 1.05,7.15 1.65,7.75 v1.65,8.89
  other vias: 40.51,3.05 29.21,3.3 5.97,29.21 4.7,30.48 4.7,27.94 7.24,27.94 7.24,30.48 30.73,20.19 28.96,18.41 30.73,16.64 32.51,18.41 30.73,18.41 29.84,19.3 29.84,17.53 31.62,17.53 31.62,19.3 3.56,13.97 3.17,8.89 17.27,8.89 13.08,16.64 37.08,36.2 24.38,0.89 23.11,8.26 46.99,9.91 36.32,17.27 38.99,22.48 30.1,28.83 19.68,29.59 22.23,34.67 30.61,33.78 40.89,32.38 47.24,24.64 57.4,24.38 59.94,17.78 57.28,13.72 63.12,17.14 63.12,15.24 60.58,12.06 53.85,32 55.75,31.37 62.61,26.92 58.55,30.73 54.74,27.43 46.61,17.78 54.86,0.89 33.27,26.04 37.08,22.23 19.3,4.57 55.75,4.06 4.7,8.89 44.45,23.11 57.53,11.18 1.52,27.3 1.52,13.97 30.73,21.97 29.84,21.08 28.96,20.19 28.07,19.3 27.18,18.41 28.07,17.53 28.96,16.64 29.84,15.75 30.73,14.86 31.62,15.75 32.51,16.64 33.4,17.53 31.62,21.08 32.51,20.19 33.4,19.3 34.29,18.41 36.45,33.02 16.13,24.89 3.43,35.56 58.67,27.43 50.42,15.88 40.26,11.11 41.66,26.42 21.97,27.69 21.46,14.48 26.8,27.18 18.92,19.56 36.83,29.46 53.85,5.08
  pour Route2 (rank 2): -0.38,0 65.66,0 65.66,38.1 -0.38,38.1
  pour Top (rank 6): -0.38,0 -0.38,38.1 65.66,38.1 65.66,0
  pour Bottom (rank 6): -0.38,0 65.66,0 65.66,38.1 -0.38,38.1
GREEN
  Top 0.254: U2.32 57.14,14.72 57.93,15.51 RN23.2 60.08,15.51 | G/Y.1 61.47,20.95 61.09,20.57 61.09,15.88 60.73,15.51 RN23.7 60.08,15.51 | RN23.6 60.11,15.49 60.08,15.51
HSYNC47#
  Top 0.203: RN41.6 55.26,35.03 56.01,34.29 HS#.1
HSYNC#
  Top 0.203: U4.1 40.09,35.9 39.62,35.43 39.62,34.73 U1.101
N$1
  Top 0.203: R31.2 R32.2 43.52,27.47 43.98,27.02 U3.P$1
N$2
  Top 0.203: U2.37 54.46,18.9 55.75,20.19 R21.1
N$3  (via drill 0.4)
  Top 0.203: U1.23 25.53,10.03 25.53,11.68 v25.53,12.19 | RN12.5 9.46,24.2 9.78,23.88 v9.78,22.86
  Bottom 0.203: v9.78,22.86 11.94,22.86 19.56,15.24 23.24,15.24 25.53,12.95 v25.53,12.19
N$4
  Top 0.203: U2.24 54.46,7.09 51.69,4.32 45.09,4.32 43.18,6.22 34.79,6.22 U1.43
  pour Route2: 47.78,1.17 52.53,1.17 52.53,2.39 47.78,2.39
  pour Route15: 47.78,1.17 52.53,1.17 52.53,2.39 47.78,2.39
N$5
  Top 0.203: U2.23 53.81,7.2 51.44,4.83 45.34,4.83 43.43,6.73 36.41,6.73 U1.46
N$6
  Top 0.203: U2.22 53.31,7.46 51.18,5.33 45.59,5.33 43.69,7.24 38.02,7.24 U1.49
N$7
  Top 0.203: U2.21 52.81,7.73 50.93,5.84 45.85,5.84 43.94,7.75 38.22,7.75 U1.50
N$8
  Top 0.203: R14.1 19.68,10.54 U1.14
N$9
  Top 0.203: U2.20 52.31,7.99 50.67,6.35 46.1,6.35 44.2,8.26 38.42,8.26 U1.51
N$10
  Top 0.203: U2.19 51.81,8.25 50.42,6.86 46.35,6.86 44.45,8.76 38.62,8.76 U1.52
N$11
  Top 0.203: U2.18 51.31,8.51 50.16,7.37 46.61,7.37 44.7,9.27 38.82,9.27 U1.53
N$12
  Top 0.203: U2.17 50.81,8.78 49.91,7.87 46.86,7.87 44.96,9.78 39.02,9.78 U1.54
N$13
  Top 0.203: U2.16 50.31,9.04 49.66,8.38 47.12,8.38 45.21,10.29 39.22,10.29 U1.55
N$14
  Top 0.203: U2.3 46.02,15.72 U1.72
N$15
  Top 0.254: U3.P$4 49.87,28.86 C33.1
N$16
  Top 0.254: U3.P$3 47.13,26.4 47.5,26.04 50.03,26.04 C34.1
N$17
  Top 0.254: R33.1 C34.2 C33.2
N$18
  Top 0.203: U2.4 45.6,15.22 U1.71
N$19
  Top 0.203: U2.5 45.39,14.72 U1.70
N$20
  Top 0.203: U2.6 45.18,14.22 U1.69
N$21
  Top 0.203: R33.2 62.48,25.91 CS75#.1
N$22  (via drill 0.4)
  Top 0.203: U2.38 v53.81,20.99
  Bottom 0.203: v53.81,20.99 53.89,20.99 R22.1
N$23  (via drill 0.4)
  Top 0.203: U2.35 56.48,16.22 56.9,16.64 56.9,18.67 v56.52,19.05
  Bottom 0.203: v56.52,19.05 C22.2
N$24  (via drill 0.4)
  Top 0.203: U2.36 55.81,17.46 v56.13,17.78
  Bottom 0.203: v56.13,17.78 56.77,17.78 58.55,19.56 C21.2
N$25  (via drill 0.4)
  Top 0.203: U1.132 22.99,22.27 22.99,14.99 23.5,14.48 v23.5,12.45
  Bottom 0.203: U5.3 4.7,12.45 6.73,14.48 8.38,14.48 8.93,13.93 R52.1 8.93,12.79 9.4,12.32 11.94,12.32 12.83,13.21 16.64,13.21 17.4,12.45 v23.5,12.45
N$26
  Top 0.254: U4.2 42.49,35.25 42.93,35.69 42.93,36.2 43.43,36.7 46.74,36.7 47.61,35.83 RN41.2
N$27
  Top 0.203: U2.7 44.98,13.72 U1.68
N$28
  Top 0.203: U2.8 44.77,13.22 U1.67
N$29
  Top 0.203: U2.9 44.56,12.72 U1.66
N$30
  Top 0.203: U2.10 44.35,12.22 U1.65
N$31
  Top 0.203: U2.11 41.32,11.72 U1.60
N$32
  Top 0.203: U2.12 41.26,11.07 U1.59
N$33
  Top 0.203: U2.41 52.31,20.59 49.15,23.75 46.48,23.75 45.21,25.02 41.23,25.02 U1.85
N$34
  Top 0.203: U2.42 51.81,20.32 48.9,23.24 46.23,23.24 44.96,24.51 41.43,24.51 U1.84
N$35
  Top 0.203: U2.43 51.31,20.06 48.64,22.73 45.97,22.73 44.7,24 41.62,24 U1.83
N$36
  Top 0.203: U2.44 50.81,19.8 48.39,22.23 44.09,22.23 U1.77
N$37
  Top 0.203: U2.45 50.31,19.54 48.13,21.72 44.29,21.72 U1.76
N$38
  Top 0.203: U2.46 49.81,19.28 47.88,21.21 44.49,21.21 U1.75
N$39
  Top 0.203: U1.74 44.69,20.7 47.62,20.7 49.31,19.01 U2.47
N$40
  Top 0.203: U1.73 45.1,20.19 47.37,20.19 48.77,18.8 48.77,18.2 U2.48
N$41
  Top 0.203: RN10.5 10.1,15.31 14.86,20.07 16.5,20.07 U1.144
N$42
  Top 0.203: U1.143 16.78,20.7 14.61,20.7 10.01,16.11 RN10.6
N$43
  Top 0.203: U1.142 16.98,21.21 14.22,21.21 9.92,16.91 RN10.7
N$44
  Top 0.203: U1.141 17.18,21.72 13.84,21.72 9.84,17.71 RN10.8
N$45
  Top 0.203: U1.9 18.94,13.34 16.38,13.34 15.24,14.48 R15.1
N$46
  Top 0.203: U1.138 18.54,22.48 13.72,22.48 10.99,19.75 RN11.5
N$47
  Top 0.254: U4.5 45.42,33.95 45.65,34.23 RN41.4
N$48
  Top 0.813: P_VCC_5V.1 FB2.1
  Top 1.016: J6.2 P_VCC_5V.1
N$49
  Top 0.203: U1.137 18.74,22.99 13.33,22.99 10.9,20.55 RN11.6
N$50
  Top 0.203: U1.136 18.94,23.5 12.95,23.5 10.81,21.36 RN11.7
N$51
  Top 0.203: U1.135 19.14,24 12.57,24 10.72,22.16 RN11.8
N$52
  Top 0.203: U1.92 39.2,27.94 39.12,27.94 R16.2
N$53
  Top 0.203: RN10.4 1.09,15.31 D0.P$1
N$54
  Top 0.813: P_VCC_3V.1 FB1.1
N$55
  Top 0.203: U1.129 21.73,25.65 10.79,25.65 10.14,25 RN12.6
N$56
  Top 0.203: U1.128 21.93,26.16 10.54,26.16 10.18,25.8 RN12.7
N$57
  Top 0.203: RN12.8 8.74,26.67 22.12,26.67 U1.127
N$58
  Top 0.203: D1.P$1 5.84,16.51 6.24,16.11 RN10.3
N$59
  Top 0.203: D2.P$1 5.33,17.78 6.2,16.91 RN10.2
N$60
  Top 0.203: D3.P$1 4.95,19.05 6.29,17.71 RN10.1
N$61
  Top 0.203: D4.P$1 4.95,20.32 5.52,19.75 RN11.4
N$62
  Top 0.203: D5.P$1 4.57,21.59 5.61,20.55 RN11.3
N$63
  Top 0.203: D6.P$1 4.19,22.86 5.7,21.36 RN11.2
N$64
  Top 0.203: DSYNC#.P$1 3.68,24.13 5.66,22.16 RN11.1
N$65
  Top 0.203: CLOCK#.P$1 3.3,25.4 4.5,24.2 RN12.4
N$66  (via drill 0.4)
  Top 0.203: CTRL.1 v61.34,3.17 | v5.59,26.67 5.66,26.6 RN12.1
  Bottom 0.203: v5.59,26.67 6.22,26.67 8.25,24.64 12.7,24.64 20.57,16.76 24,16.76 26.8,13.97 34.54,13.97 39.37,9.14 53.21,9.14 59.18,3.17 v61.34,3.17
N$67  (via drill 0.4)
  Top 0.203: /COLD.1 v58.04,3.17 | v4.06,26.67 4.93,25.8 RN12.2
  Bottom 0.203: v58.04,3.17 52.58,8.64 39.12,8.64 34.29,13.46 26.54,13.46 23.75,16.26 20.32,16.26 12.45,24.13 7.75,24.13 6.1,25.78 4.95,25.78 v4.06,26.67
N$68
  Top 0.254: RN41.3 45.61,35.03 45.4,35.25 U4.7
N$69
  Bottom 0.203: R51.1 8.93,10.2 8.38,9.65 6.48,9.65 5.97,10.16 U5.2
N$70  (via drill 0.4)
  Top 0.203: /RST.1 v54.74,3.17 | v5.59,25.02 5.61,25 RN12.3
  Bottom 0.203: v5.59,25.02 6.98,23.62 12.19,23.62 20.07,15.75 23.5,15.75 26.29,12.95 34.04,12.95 38.86,8.13 52.2,8.13 54.74,5.59 v54.74,3.17
N$72  (via drill 0.4)
  Top 0.203: U1.13 20.37,11.94 v15.75,11.94
  Bottom 0.203: v15.75,11.94 15.11,11.3 R51.2
N$73  (via drill 0.4)
  Top 0.203: U1.12 20.42,12.7 15.62,12.7 15.11,13.21 8.25,13.21 7.75,12.7 6.48,12.7 v5.21,13.97
  Bottom 0.203: v5.21,13.97 4.7,14.48 U5.6
N$74  (via drill 0.4)
  Top 0.203: U1.133 22.48,22.07 v22.48,13.21
  Bottom 0.203: U5.7 5.97,15.88 6.48,15.37 R53.1 8.93,15.91 9.4,16.38 11.43,16.38 12.83,14.99 12.83,14.22 13.33,13.72 16.89,13.72 17.4,13.21 v22.48,13.21
N$75  (via drill 0.4)
  Top 0.203: U1.8 18.74,13.84 16.89,13.84 15.24,15.49 12.06,15.49 10.29,13.72 v7.24,13.72
  Bottom 0.203: U5.1 v7.24,13.72
N$76  (via drill 0.4)
  Top 0.203: v14.22,17.65 14.99,18.41 18.03,18.41 19.43,17.02 19.43,15.95 U1.6
  Bottom 0.203: v14.22,17.65 12.06,19.81 4.19,19.81 3.43,19.05 U5.5
N$77  (via drill 0.4)
  Top 0.203: U1.24 25.73,9.53 v26.54,9.53 | v6.22,8.89 6.22,9.81 6.14,9.89 U8.3
  Bottom 0.203: v26.54,9.53 23.88,9.53 22.1,11.3 16.64,11.3 14.22,8.89 v6.22,8.89
N$78  (via drill 0.4)
  Top 0.203: v27.56,8.51 27.55,8.51 U1.28 | v14.35,12.19 13.84,12.7 8.76,12.7 8.29,12.23 8.39,12.13 U8.1
  Bottom 0.203: v14.35,12.19 14.86,12.7 16.13,12.7 16.89,11.94 22.48,11.94 24,10.41 27.05,10.41 27.56,9.91 v27.56,8.51
N$81  (via drill 0.5)
  other vias: 16.13,29.21
N$82  (via drill 0.5)
  other vias: 14.86,27.94
RED
  Top 0.254: R/PR.1 59.31,22.86 58.51,22.06 RN23.1 57.84,16.31 57.25,15.72 U2.34
RGSB#
  Top 0.203: U1.38 33.15,4.33 33.15,3.56 32.38,2.79 J2.1
SL_STR_0
  Top 0.203: J3.3 29.84,1.91 30.35,2.41 30.35,5.33 29.84,5.84 29.12,5.84 U1.34
SL_STR_1
  Top 0.203: U1.33 26.04,3.46 J3.1
TCK
  Top 0.203: U1.16 17.53,6.97 17.53,3.17 16.26,1.91 12.32,1.91 11.56,2.67 11.56,4.06 11.05,4.57 6.48,4.57 J5.1
  Bottom 0.203: J5.1 3.81,4.7 3.17,4.7 2.79,5.08 2.79,5.8 R11.1
TDI
  Top 0.203: U1.15 17.02,7.17 17.02,4.95 J5.9
  Bottom 0.203: J5.9 R13.1
TDO
  Top 0.203: U1.20 20.07,6.69 20.07,3.81 17.65,1.4 9.65,1.4 J5.3
TMS  (via drill 0.4)
  Top 0.203: U1.18 22.35,10.39 22.35,9.65 v18.54,5.84
  Bottom 0.203: v18.54,5.84 17.14,4.45 11.43,4.45 J5.5 8.51,1.52 3.94,1.52 2.75,2.71 R12.1
USE_VGA
  Top 0.203: J1.3 29.08,33.78 30.48,32.38 30.48,31.62 29.84,30.99 29.12,30.99 U1.111
VCCA  (via drill 0.4, 0.5)
  Top 0.203: U1.96 35.1,26.67 v34.92,26.67
  Top 0.254: v28.07,4.06 28.97,4.96 U1.35 | U1.107 33.67,33.02 v33.91,33.02
  Top 0.406: 20.47,36.51 U7.5
  Top 0.813: 20.47,36.51 C702.1 20.61,36.45 v22.48,36.45 v23.75,36.45
  Route15 0.254: v28.07,4.06 26.67,2.67 20.19,2.67 v19.56,2.03
  Route15 0.406: v23.75,36.45 30.48,36.45 v33.91,33.02 34.92,32 34.92,27.69 | v28.07,4.06 30.48,6.48 38.61,6.48 44.83,12.7 44.83,21.34 39.5,26.67 35.94,26.67 | 34.92,27.69 v34.92,26.67 | v34.92,26.67 35.94,26.67 | 35.43,27.18 35.94,26.67 | 35.37,27.24 34.92,27.69 | v34.92,26.67 34.92,26.8 35.37,27.24 | 35.43,26.67 35.43,27.18 | 35.43,27.18 35.37,27.24
  Bottom 0.254: C141.1 v28.07,4.06 | v28.07,4.06 | C142.1 v33.91,33.02 | v33.91,33.02 | R13.2 19.56,3.26 v19.56,2.03 18.54,1.02 2.29,1.02 1.02,2.29 1.02,3.26 R12.2
VCCD_PLL  (via drill 0.4)
  Top 0.254: U1.109 28.46,33.27 v28.32,33.4 | U1.37 32.18,4.52
  Top 0.406: FB3.1 27.3,34.42 v28.32,33.4 | v24.26,18.16 24.26,16.64 30.23,10.67 30.23,6.35 v31.11,5.46 32.04,4.53 U1.37
  Bottom 0.254: C132.1 27.66,34.06 v28.32,33.4
  Bottom 0.305: C131.1 31.11,4.83 v31.11,5.46
  Bottom 0.406: v28.32,33.4 28.32,22.23 v24.26,18.16
VCCINT  (via drill 0.4, 0.5)
  Top 0.203: U1.116 25.91,30.67 v25.91,30.86 | v21.72,21.59 21.72,22.13 U1.134
  Top 0.254: v17.27,14.61 17.4,14.61 arc45 17.45,14.68 U1.5 | v25.65,5.46 25.65,5.91 U1.29 | U1.45 34.18,8.26 v33.02,8.26 | U1.61 39.27,14.48 v39.24,14.48 | U1.102 33.02,28.83 v32.77,28.83 | U1.78 41.66,20.5 v41.66,19.68
  Top 0.305: C121.1 23.43,32.48 23.32,32.6
  Top 0.406: U6.5 20.47,32.7 C602.1 23.32,32.6 | FB3.2 23.43,34.32 C121.1
  Top 0.813: C121.1 23.43,31.69 v20.83,29.08 v19.3,27.56
  Route15 0.305: 30.99,26.8 v32.77,28.83 | 40.01,17.91 41.27,19.18 v41.66,19.68
  Route15 0.381: v17.27,14.61 17.27,11.94 23.75,5.46 v25.65,5.46 | v39.24,14.48 39.24,12.19 35.31,8.26 v33.02,8.26
  Route15 0.406: v19.3,27.56 19.3,24 v21.72,21.59 21.72,19.05 v17.27,14.61 | v20.83,29.08 22.61,30.86 v25.91,30.86 29.97,26.8 | 29.97,26.8 30.99,26.8 30.99,25.78 | 30.73,26.04 30.99,25.78 | 30.73,26.04 30.23,26.54 | 30.23,26.54 29.97,26.8 | 30.23,26.54 30.73,26.54 30.73,26.04 | 30.99,25.78 38.86,17.91 | 38.86,17.91 40.01,17.91 40.01,16.76 | 40.01,16.76 39.75,17.02 | 39.75,17.02 39.12,17.65 | 39.12,17.65 38.86,17.91 | 39.12,17.65 39.75,17.65 39.75,17.02 | 40.01,16.76 40.01,15.24 v39.24,14.48
  Bottom 0.203: C129.1 v21.72,21.59 | C128.1 25.91,31.37 v25.91,30.86
  Bottom 0.254: C122.1 v17.27,14.61 | C123.1 v25.65,5.46 | v25.65,5.46 arc45 v25.65,5.46 | v33.02,8.26 C124.1 | C125.1 v39.24,14.48 | C127.1 v32.77,28.83 | v32.77,28.83
  Bottom 0.305: v41.66,19.68 C126.1
  Bottom 0.813: v20.83,29.08 v19.3,27.56
VCCIO  (via drill 0.4, 0.5)
  Top 0.203: U7.1 16.2,36.51 16.51,36.2 16.51,34.92 16.2,34.61 U7.3 | U6.1 16.2,32.7 16.51,32.38 16.51,31.11 16.2,30.8 U6.3 | R15.2 v12.06,14.48 | v40.26,29.97 39.41,29.97 R16.1 | U1.7 20.03,15.84 20.03,20.28 | U1.105 v32.16,30.1 | U1.119 24.38,30.07 v24.38,30.1 | U1.80 41.08,21.34 v40.26,21.34
  Top 0.254: U1.117 25.77,30.1 v24.38,30.1 | U1.122 23.63,28.7 v22.99,28.7 | U1.139 20.03,20.28 arc-45 v20.07,20.19 | U1.130 23.11,23.57 arc45 23.28,23.5 v23.37,23.5 | U1.17 21.41,10.15 arc45 21.34,9.97 v21.34,9.78 | U1.26 24.55,6.93 arc-45 24.38,6.86 v24.26,6.86 | U1.40 34.45,4.45 v34.8,4.45 | U1.47 34.42,9.43 v34.42,9.65 | U1.62 41.88,12.57 v42.29,12.57 | U1.93 36.2,25.65 v36.07,25.65 | U1.81 40.39,21.35 v40.26,21.34 | v13.84,10.54 R14.2 | U1.56 37.59,12.62 v37.46,12.7
  Top 0.305: FB4.1 13.37,11.64 13.84,11.18 v13.84,10.54
  Top 0.406: U7.1 13.18,36.51 C701.1 | U6.1 13.05,32.7 C601.1 | v59.69,4.32 61.72,4.32 J6.1 | v61.34,4.32 62.11,4.32
  Top 1.016: v59.69,4.32 62.11,4.32 v62.99,4.32 J6.1
  Route15 1.016: v59.69,4.32 v62.99,4.32
  Bottom 0.203: R52.2 11.68,13.34 12.06,13.72 v12.06,14.48 12.06,14.99 11.68,15.37 R53.2
  Bottom 0.254: C111.1 v22.99,28.7 | C110.1 v24.38,30.1 | C113.1 v20.07,20.19 | C112.1 v23.37,23.5 | C102.1 v21.34,9.78 | v21.34,9.78 arc45 v21.34,9.78 | C103.1 v24.26,6.86 | C104.1 v34.8,4.45 | v37.46,12.7 C106.1 | C105.1 v34.42,9.65 | C107.1 v42.29,12.57 | C109.1 35.94,25.53 v36.07,25.65 | C108.1 40.26,21.21 v40.26,21.34 | C501.1 v8.13,18.54 | U5.8 7.24,18.54 7.72,18.54 | 7.72,18.54 v8.13,18.54 | v8.13,18.54 8.08,18.54 U5.8 | U5.8 7.24,18.06 7.72,18.54
  other vias: 11.68,36.96 10.29,35.56 10.29,34.16 11.68,29.21 10.29,29.21 11.68,27.81 10.29,27.81 10.29,36.96 11.68,34.16 13.08,27.81 13.08,29.21 11.68,35.56
  pour Top: 7.24,31.75 13.08,31.75 13.08,37.47 7.24,37.47
  pour Route15 (rank 4): 9.4,38.1 9.4,33.27 12.57,33.27 12.57,38.1 65.66,38.1 65.66,0 -0.38,0 -0.38,38.1
  pour Bottom (rank 4): 9.78,27.3 13.59,27.3 13.59,32.26 12.19,33.66 12.19,38.1 9.78,38.1
VCCIO_CO
  Top 0.305: FB4.2 12.22,9.97 10.26,9.97 10.29,9.87 C801.1 8.44,9.95 U8.4
VSYNC47#
  Top 0.254: RN41.5 54.03,34.23 56.13,32.38 VS#.1
VSYNC#
  Top 0.203: U1.100 40.2,34.6 U4.3
YPBPR#
  Top 0.203: J2.3 35.43,2.76 U1.39

### Text on the board
Top: 1
Route2: 2
Route15: 3
Bottom: 4
tPlace: __/)__/)_ | N64 | Advanced
tNames: C1 | /CS | U4 | /HS|F1 | FB3 | J1 | +3V3 | C702 | RN41 | /VS|F2 | U7 | C301 | GND | FB1 | C701 | C121 | R31 | C302 | C601 | C602 | U6 | R32 | R16 | C33 | GND | R33 | U3 | /CS | /Clk | C34 | /DS | RN12 | (75Ω) | R/Pr | R21 | RN11 | Gs/Y | D0-D6 | U1 | U2 | B/Pb | RN10 | R15 | RN23 | GND | U8 | C801 | FB4 | GND | R14 | FB2 | +5V | C2 | J4 | J6 | J5 | J3 | J2 | /RST | /C | Ctrl
bNames: C142 | C132 | C401 | C101 | C110 | C128 | C111 | C127 | C109 | C108 | R22 | C22 | C21 | C112 | C126 | C129 | C501 | C113 | U5 | C206 | R53 | C122 | C125 | C202 | C205 | R52 | C106 | C201 | C204 | R51 | C107 | C102 | C105 | C203 | R11 | C103 | C124 | C104 | R12 | R13 | C123 | C141 | C131 | N64A_20171204